# Altium schematic sheet FPGA_CFG.SchDoc
size A4; SheetNumber: 9; SheetTotal: 14
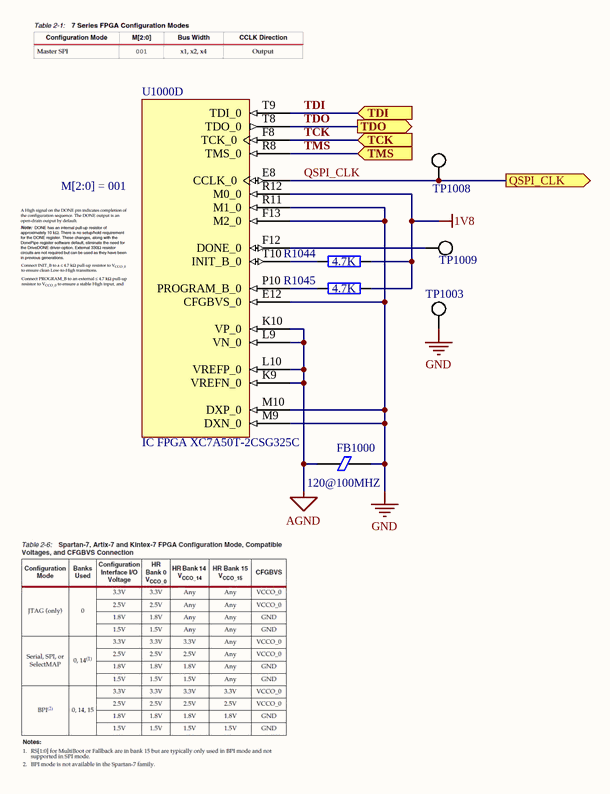
[diagram p0: FPGA_CFG.SchDoc]

## Parts
FB1000  120@100MHZ  [GEN_R_0402]
R1044  4.7K  [GEN_R_0201]
R1045  4.7K  [GEN_R_0201]
TP1003  PCB  [GEN_TP_PCB]  (value not drawn)  (no BOM)
TP1008  PCB  [GEN_TP_PCB]  (value not drawn)  (no BOM)
TP1009  PCB  [GEN_TP_PCB]  (value not drawn)  (no BOM)
U1000  IC FPGA XC7A50T-2CSG325C  [XILINX_XC7A50T-2CSG325C]  (part D of 9)

## Ports
QSPI_CLK (out), TCK (in), TDI (in), TDO (out), TMS (in)

## Nets
1V8: R1044.2 R1045.2 U1000.R12(M0_0)
AGND: FB1000.1 U1000.K9(VREFN_0) U1000.K10(VP_0) U1000.L9(VN_0) U1000.L10(VREFP_0)
GND: FB1000.2 TP1003.1 U1000.E12(CFGBVS_0) U1000.F13(M2_0) U1000.M9(DXN_0) U1000.M10(DXP_0) U1000.R11(M1_0)
QSPI_CLK: TP1008.1 U1000.E8(CCLK_0) ; port QSPI_CLK
TCK: U1000.F8(TCK_0) ; port TCK
TDI: U1000.T9(TDI_0) ; port TDI
TDO: U1000.T8(TDO_0) ; port TDO
TMS: U1000.R8(TMS_0) ; port TMS
NetR1044_1: R1044.1 U1000.T10(INIT_B_0)
NetR1045_1: R1045.1 U1000.P10(PROGRAM_B_0)
NetTP1009_1: TP1009.1 U1000.F12(DONE_0)

## Notes on the sheet
- M[2:0] = 001

## Library data of the parts
FB1000 = FERRITE BEAD 120 OHM 0402: House Part Number: BLM15PX121SN1D; Manufacturer: Murata; Supplier 1: Mouser; Supplier Part Number 1: 81-BLM15PX121SN1D; Manufacturer Part Number: BLM15PX121SN1D
R1044 R1045 = RES 4.7K OHM 1% 1/20W 0201: House Part Number: R-4.7K-0201-1%-001; Manufacturer: Yageo; Manufacturer Part Number: RC0201FR-074K7L; Tolerance: 1%; Package: 0201; Supplier 1: Mouser; Supplier Part Number 1: 603-RC0201FR-074K7L; Value: 4.7K
TP1003 TP1008 TP1009 = TP PCB 1mm
U1000 = IC FPGA XC7A50T-2CSG325C: Artix-7 FPGA, 150 User I/Os, 4 GTP, 324-Ball BGA, Speed Grade 2, Commercial Grade, Pb-Free; Manufacturer: Xilinx; House Part Number: XC7A50T-2CSG325C; Manufacturer Part Number: XC7A50T-2CSG325C; Supplier 1: Digi-Key; Supplier Part Number 1: 122-2193-ND